# EAGLE design MG307_RFM69CW_V3 (EAGLE 8.6.1)
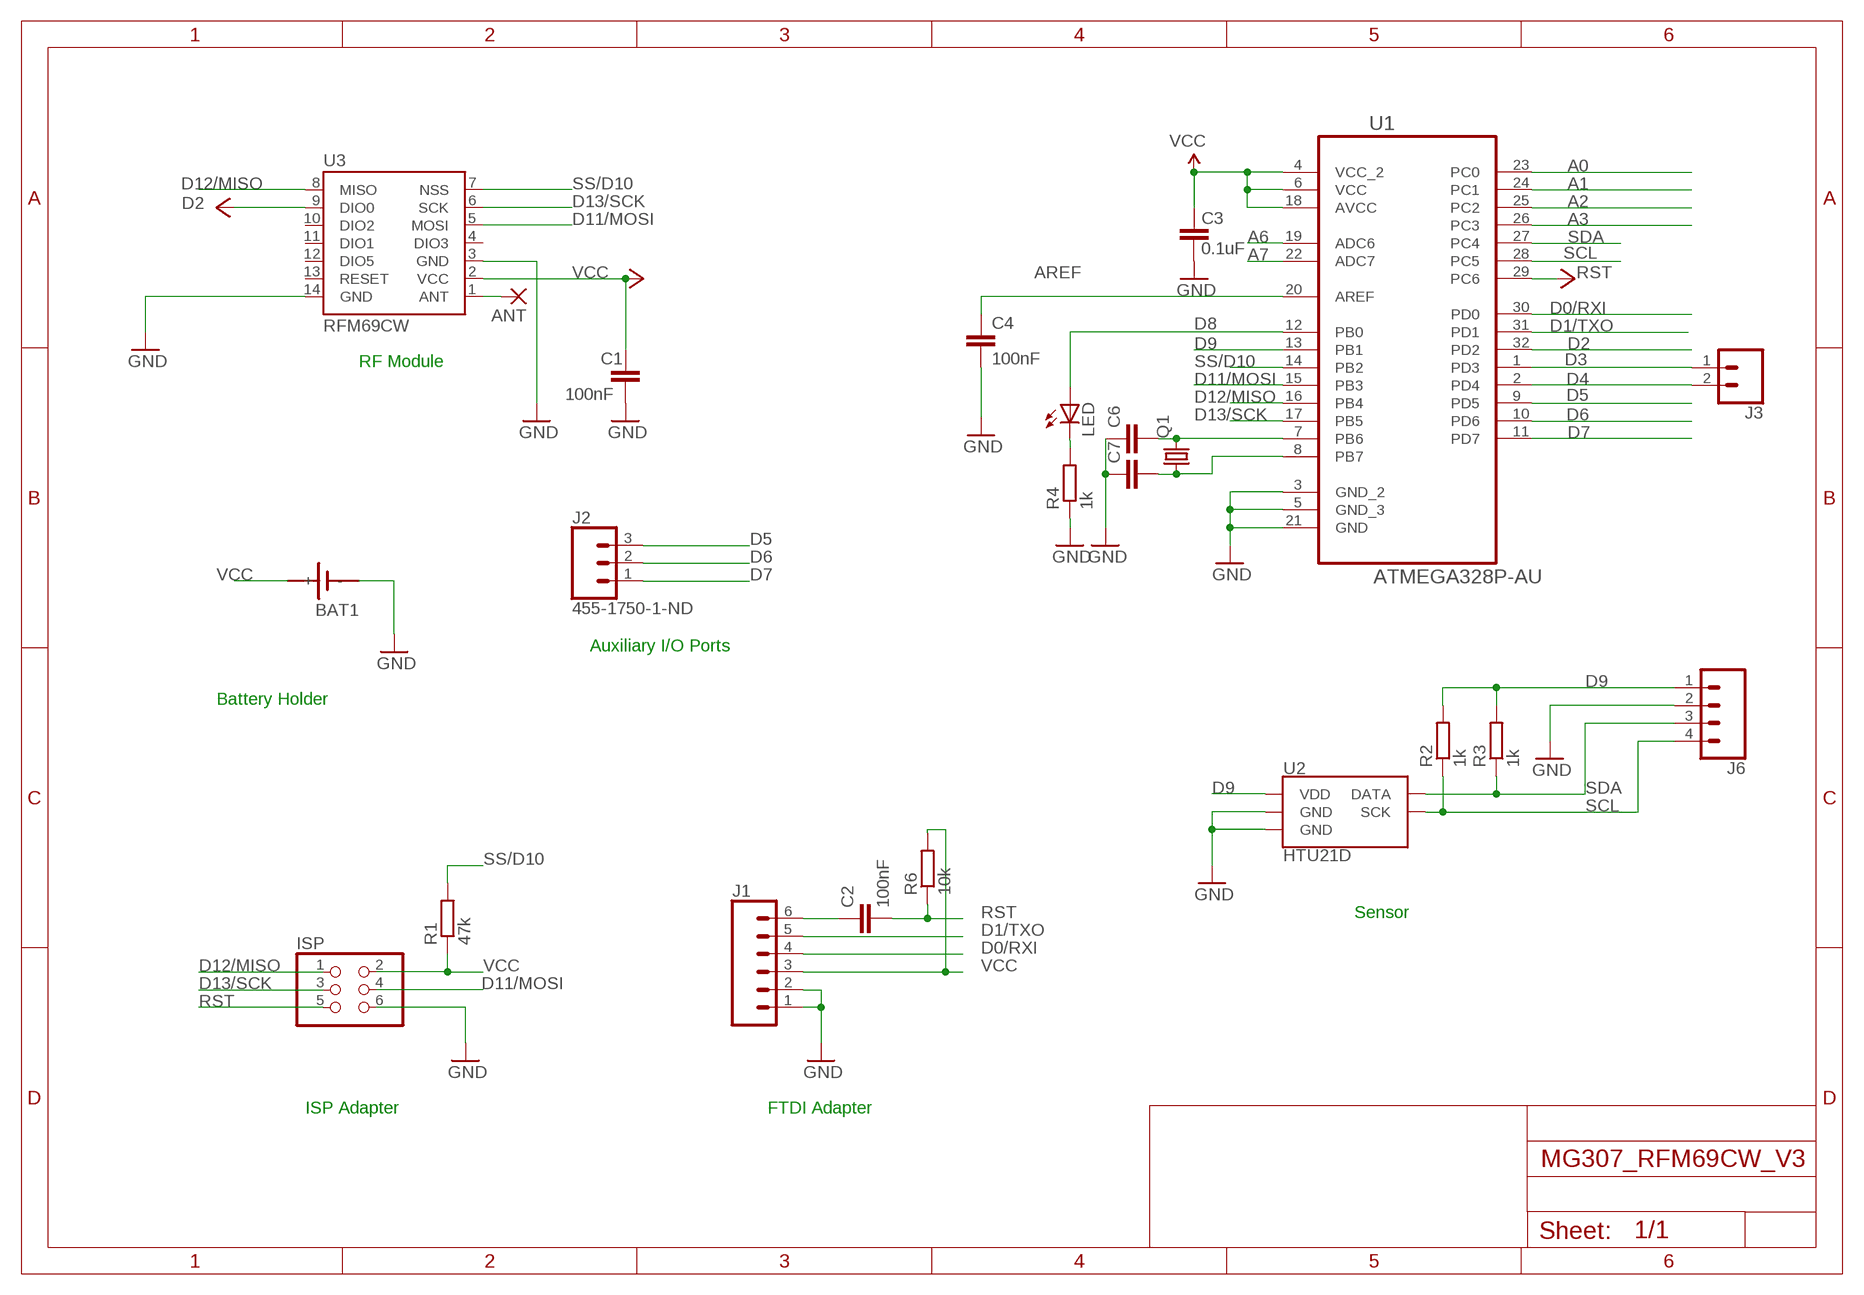
[diagram p0: schematic, sheet 1]

## Parts
ANT  WIREPAD1,6/0,9  [1,6/0,9]
BAT1  SN2032  [SN2032]
C1  100nF  C-EUC0603  [C0603]
C2  100nF  C-EUC0603  [C0603]
C3  0.1uF  CAP0603-CAP  [0603-CAP]
C4  100nF  C-EUC0603  [C0603]
C6  C-EUC0402  [C0402]
C7  C-EUC0402  [C0402]
ISP  PINHD-2X3  [2X03]
J1  CONN_06SILK_FEMALE_PTH  [1X06]
J2  455-1750-1-ND  CONN_03  [1X03]
J3  CONN_02  [1X02]
J6  CONN_04  [1X04]
LED  LEDCHIPLED_0603  [CHIPLED_0603]
Q1  CRYSTALTC26V  [TC26V]
R1  47k  R-EU_R0603  [R0603]
R2  1k  R-EU_R0603  [R0603]
R3  1k  R-EU_R0603  [R0603]
R4  1k  R-EU_R0603  [R0603]
R6  10k  R-EU_R0603  [R0603]
U1  ATMEGA328P-AU  [QFP80P900X900X120-32N]
U2  HTU21D  [DFN-6-3X3-HTU21D]
U3  RFM69CW  [RFM69CW]

## Nets
A0: U1.23(PC0)
A1: U1.24(PC1)
A2: U1.25(PC2)
A3: U1.26(PC3)
A6: U1.19(ADC6)
A7: U1.22(ADC7)
ANT: ANT.1(P) U3.1(ANT)
AREF: C4.1 U1.20(AREF)
D0/RXI: J1.4 U1.30(PD0)
D1/TXO: J1.5 U1.31(PD1)
D2: U1.32(PD2) U3.9(DIO0)
D3: J3.1 U1.1(PD3)
D4: J3.2 U1.2(PD4)
D5: J2.3 U1.9(PD5)
D6: J2.2 U1.10(PD6)
D7: J2.1 U1.11(PD7)
D8: LED.A U1.12(PB0)
D9: J6.1 R2.2 R3.2 U1.13(PB1) U2.VDD
D11/MOSI: ISP.4 U1.15(PB3) U3.5(MOSI)
D12/MISO: ISP.1 U1.16(PB4) U3.8(MISO)
D13/SCK: ISP.3 U1.17(PB5) U3.6(SCK)
DTR: C2.1 J1.6
GND: BAT1.- C1.2 C3.1 C4.2 C6.1 C7.1 ISP.6 J1.1 J1.2 J6.2 R4.1 U1.3(GND_2) U1.5(GND_3) U1.21(GND) U2.7(GND) U2.GND U3.14(GND)
GND1: LED.C R4.2
N$6: C6.2 Q1.2 U1.7(PB6)
N$7: C7.2 Q1.1 U1.8(PB7)
RST: C2.2 ISP.5 R6.1 U1.29(PC6)
SCL: J6.4 R2.1 U1.28(PC5) U2.SCK
SDA: J6.3 R3.1 U1.27(PC4) U2.DATA
SS/D10: R1.2 U1.14(PB2) U3.7(NSS)
VCC: BAT1.+ C1.1 C3.2 ISP.2 J1.3 R1.1 R6.2 U1.4(VCC_2) U1.6(VCC) U1.18(AVCC) U3.2(VCC)
Unconnected: U3.4(DIO3) U3.10(DIO2) U3.11(DIO1) U3.12(DIO5)

## Notes on the sheet
- RF Module
- Auxiliary I/O Ports
- Battery Holder
- Sensor
- ISP Adapter | FTDI Adapter

## Power pins joined to a net without a drawn wire
GND: U3.3(GND)
RESET: U3.13(RESET)

## Library data of the parts
ANT = wirepad:WIREPAD: Wire PAD connect wire on PCB
BAT1 = sn2032_AH:SN2032: LI BATTERY
C1 C2 C4 C6 C7 = rcl:C-EU: CAPACITOR, European symbol; SPICEPREFIX: C
C3 = SparkFun:CAP: Capacitor Standard 0603 ceramic capacitor, and 0.1" leaded capacitor.
ISP = pinhead:PINHD-2X3: PIN HEADER
J1 = SparkFun-Connectors:CONN_06: Multi connection point. Often used as Generic Header-pin footprint for 0.1 inch spaced/style header connections On any of the 0.1 inch spaced packages, you can populate with these: Break Away Headers - Straight <https://www.sparkfun.com/products/116> (PRT-00116) Break Away Male Headers - Right Angle <https://www.sparkfun.com/products/553> (PRT-00553) Female Headers <https://www.sparkfun.com/products/115> (PRT-00115) Break Away Headers - Machine Pin <https://www.sparkfun.com/products/117> (PRT-00117) Break Away Female Headers - Swiss Machine Pin <https://www.sparkfun.com/products/743> (PRT-00743) Arduino Stackable Header - 6 Pin <https://www.sparkfun.com/products/9280> (PRT-09280) For SCREWTERMINALS and SPRING TERMINALS visit here: Screw Terimnals on SparkFun.com <https://www.sparkfun.com/search/results?term=Screw+Terminals> (5mm/3.5mm/2.54mm spacing) This device is also useful as a general connection point to wire up your design to another part of your project. Our various solder wires solder well into these plated through hole pads. Hook-Up Wire - Assortment (Stranded, 22 AWG) <https://www.sparkfun.com/products/11375> (PRT-11375) Hook-Up Wire - Assortment (Solid Core, 22 AWG) <https://www.sparkfun.com/products/11367> (PRT-11367) View the entire wire category on our website here <https://www.sparkfun.com/categories/141>; PROD_ID: CONN-08437
J2 = SparkFun-Connectors:CONN_03: Multi connection point. Often used as Generic Header-pin footprint for 0.1 inch spaced/style header connections On any of the 0.1 inch spaced packages, you can populate with these: Break Away Headers - Straight <https://www.sparkfun.com/products/116> (PRT-00116) Break Away Male Headers - Right Angle <https://www.sparkfun.com/products/553> (PRT-00553) Female Headers <https://www.sparkfun.com/products/115> (PRT-00115) Break Away Headers - Machine Pin <https://www.sparkfun.com/products/117> (PRT-00117) Break Away Female Headers - Swiss Machine Pin <https://www.sparkfun.com/products/743> (PRT-00743) Stackable Header - 3 Pin (Female, 0.1") <https://www.sparkfun.com/products/13875> (PRT-13875) For SCREWTERMINALS and SPRING TERMINALS visit here: Screw Terimnals on SparkFun.com <https://www.sparkfun.com/search/results?term=Screw+Terminals> (5mm/3.5mm/2.54mm spacing) This device is also useful as a general connection point to wire up your design to another part of your project. Our various solder wires solder well into these plated through hole pads. Hook-Up Wire - Assortment (Stranded, 22 AWG) <https://www.sparkfun.com/products/11375> (PRT-11375) Hook-Up Wire - Assortment (Solid Core, 22 AWG) <https://www.sparkfun.com/products/11367> (PRT-11367) View the entire wire category on our website here <https://www.sparkfun.com/categories/141> Special notes: Molex polarized connector foot print use with SKU : PRT-08232 with associated crimp pins and housings.; PROD_ID: XXX-00000
J3 = SparkFun-Connectors:CONN_02: Multi connection point. Often used as Generic Header-pin footprint for 0.1 inch spaced/style header connections On any of the 0.1 inch spaced packages, you can populate with these: Break Away Headers - Straight <https://www.sparkfun.com/products/116> (PRT-00116) Break Away Male Headers - Right Angle <https://www.sparkfun.com/products/553> (PRT-00553) Female Headers <https://www.sparkfun.com/products/115> (PRT-00115) Break Away Headers - Machine Pin <https://www.sparkfun.com/products/117> (PRT-00117) Break Away Female Headers - Swiss Machine Pin <https://www.sparkfun.com/products/743> (PRT-00743) For SCREWTERMINALS and SPRING TERMINALS visit here: Screw Terimnals on SparkFun.com <https://www.sparkfun.com/search/results?term=Screw+Terminals> (5mm/3.5mm/2.54mm spacing) This device is also useful as a general connection point to wire up your design to another part of your project. Our various solder wires solder well into these plated through hole pads. Hook-Up Wire - Assortment (Stranded, 22 AWG) <https://www.sparkfun.com/products/11375> (PRT-11375) Hook-Up Wire - Assortment (Solid Core, 22 AWG) <https://www.sparkfun.com/products/11367> (PRT-11367) View the entire wire category on our website here <https://www.sparkfun.com/categories/141> Special notes: Molex polarized connector foot print use with: PRT-08233 with associated crimp pins and housings. 2.54_SCREWTERM for use with PRT-10571. 3.5mm Screw Terminal footprints for PRT-08084 5mm Screw Terminal footprints for use with PRT-08432
J6 = SparkFun-Connectors:CONN_04: Multi connection point. Often used as Generic Header-pin footprint for 0.1 inch spaced/style header connections On any of the 0.1 inch spaced packages, you can populate with these: Break Away Headers - Straight <https://www.sparkfun.com/products/116> (PRT-00116) Break Away Male Headers - Right Angle <https://www.sparkfun.com/products/553> (PRT-00553) Female Headers <https://www.sparkfun.com/products/115> (PRT-00115) Break Away Headers - Machine Pin <https://www.sparkfun.com/products/117> (PRT-00117) Break Away Female Headers - Swiss Machine Pin <https://www.sparkfun.com/products/743> (PRT-00743) For SCREWTERMINALS and SPRING TERMINALS visit here: Screw Terimnals on SparkFun.com <https://www.sparkfun.com/search/results?term=Screw+Terminals> (5mm/3.5mm/2.54mm spacing) This device is also useful as a general connection point to wire up your design to another part of your project. Our various solder wires solder well into these plated through hole pads. Hook-Up Wire - Assortment (Stranded, 22 AWG) <https://www.sparkfun.com/products/11375> (PRT-11375) Hook-Up Wire - Assortment (Solid Core, 22 AWG) <https://www.sparkfun.com/products/11367> (PRT-11367) View the entire wire category on our website here <https://www.sparkfun.com/categories/141> Special notes: Molex polarized connector foot print use with SKU : PRT-08231 with associated crimp pins and housings. 1MM SMD Version SKU: PRT-10208; PROD_ID: CONN-09696
LED = led:LED: LED OSRAM: - CHIPLED LG R971, LG N971, LY N971, LG Q971, LY Q971, LO R971, LY R971 LH N974, LH R974 LS Q976, LO Q976, LY Q976 LO Q996 - Hyper CHIPLED LW Q18S LB Q993, LB Q99A, LB R99A - SideLED LS A670, LO A670, LY A670, LG A670, LP A670 LB A673, LV A673, LT A673, LW A673 LH A674 LY A675 LS A676, LA A676, LO A676, LY A676, LW A676 LS A679, LY A679, LG A679 - Hyper Micro SIDELED® LS Y876, LA Y876, LO Y876, LY Y876 LT Y87S - SmartLED LW L88C, LW L88S LB L89C, LB L89S, LG L890 LS L89K, LO L89K, LY L89K LS L896, LA L896, LO L896, LY L896 - TOPLED LS T670, LO T670, LY T670, LG T670, LP T670 LSG T670, LSP T670, LSY T670, LOP T670, LYG T670 LG T671, LOG T671, LSG T671 LB T673, LV T673, LT T673, LW T673 LH T674 LS T676, LA T676, LO T676, LY T676, LB T676, LH T676, LSB T676, LW T676 LB T67C, LV T67C, LT T67C, LS T67K, LO T67K, LY T67K, LW E67C LS E67B, LA E67B, LO E67B, LY E67B, LB E67C, LV E67C, LT E67C LW T67C LS T679, LY T679, LG T679 LS T770, LO T770, LY T770, LG T770, LP T770 LB T773, LV T773, LT T773, LW T773 LH T774 LS E675, LA E675, LY E675, LS T675 LS T776, LA T776, LO T776, LY T776, LB T776 LHGB T686 LT T68C, LB T68C - Hyper Mini TOPLED® LB M676 - Mini TOPLED Santana® LG M470 LS M47K, LO M47K, LY M47K Source: http://www.osram.convergy.de LUXEON: - LUMILED® LXK2-PW12-R00, LXK2-PW12-S00, LXK2-PW14-U00, LXK2-PW14-V00 LXK2-PM12-R00, LXK2-PM12-S00, LXK2-PM14-U00 LXK2-PE12-Q00, LXK2-PE12-R00, LXK2-PE12-S00, LXK2-PE14-T00, LXK2-PE14-U00 LXK2-PB12-K00, LXK2-PB12-L00, LXK2-PB12-M00, LXK2-PB14-N00, LXK2-PB14-P00, LXK2-PB14-Q00 LXK2-PR12-L00, LXK2-PR12-M00, LXK2-PR14-Q00, LXK2-PR14-R00 LXK2-PD12-Q00, LXK2-PD12-R00, LXK2-PD12-S00 LXK2-PH12-R00, LXK2-PH12-S00 LXK2-PL12-P00, LXK2-PL12-Q00, LXK2-PL12-R00 Source: www.luxeon.com KINGBRIGHT: KA-3528ASYC Source: www.kingbright.com
Q1 = crystal:CRYSTAL: CRYSTAL; OC_FARNELL: unknown; OC_NEWARK: unknown
R1-R4 R6 = rcl:R-EU_: RESISTOR, European symbol
U1 = Atmel_By_element14_Batch_1-00:ATMEGA328P-AU: 8-bit Microcontroller with In-System Programmable Flash; MPN: ATMEGA328P-AU; OC_FARNELL: 1715486; OC_NEWARK: 14R4631; PACKAGE: TQFP-32; SUPPLIER: Atmel
U2 = SparkFun-Sensors:HTU21D: Measurement Specialties HTU21D Relative Humidity Sensor w/ Temperature HTU21D(F) digital humidity sensors are dedicated humidity and temperature plug and play transducers for OEM applications where reliable and accurate measurements are needed. Direct interface with a micro-controller is made possible with the module for humidity and temperature digital outputs. These low power sensors are designed for high volume and cost sensitive applications with tight space constraints. Datasheet <http://cdn.sparkfun.com/datasheets/BreakoutBoards/HTU21D.pdf> SparkFun Products SparkFun Humidity and Temperature Sensor Breakout - HTU21D <https://www.sparkfun.com/products/12064> (SEN-12064) SparkFun Weather Shield <https://www.sparkfun.com/products/12081> (SEN-12081) SparkFun Photon Weather Shield <https://www.sparkfun.com/products/13630> (SEN-13630); PROD_ID: IC-11793
U3 = RFM69xx:RFM69: The RFM69CW is a low-power, low cost radiotransceiver that is capable of operating in the 434MHz and 900MHz open bands. It supports OOK, FSK and GFSK Modulation. It is pin compatible to the RFM12B

## Net classes
1 vcc: width 0.254 mm

## Board
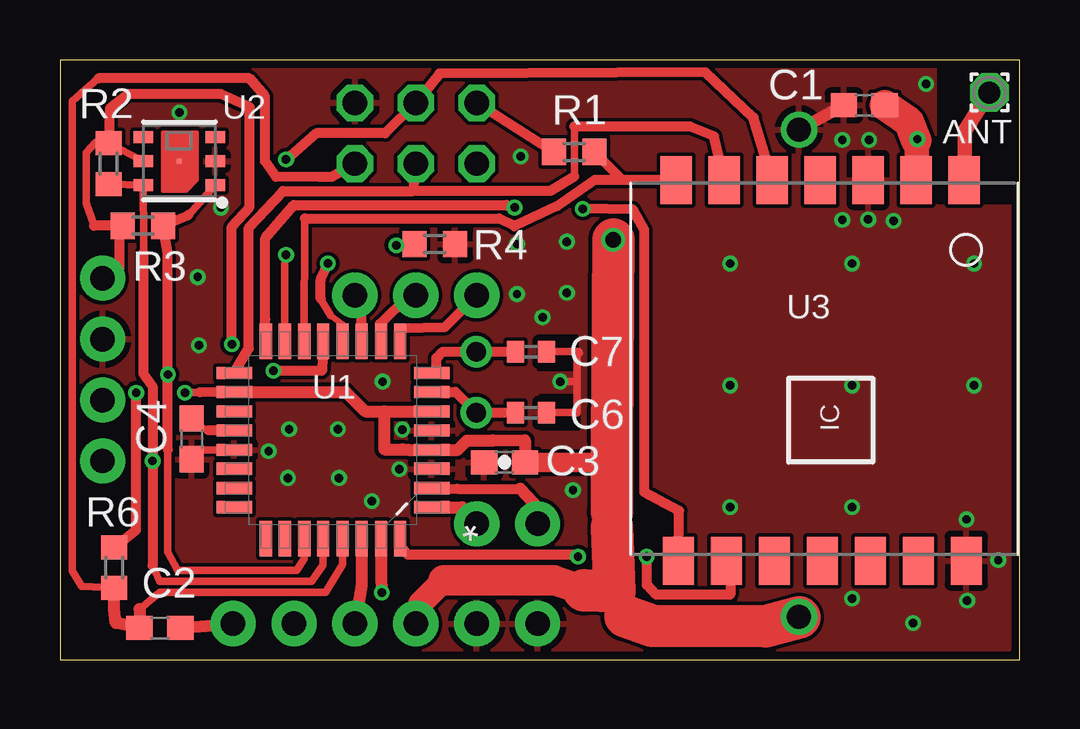
[diagram p1: board, top side]
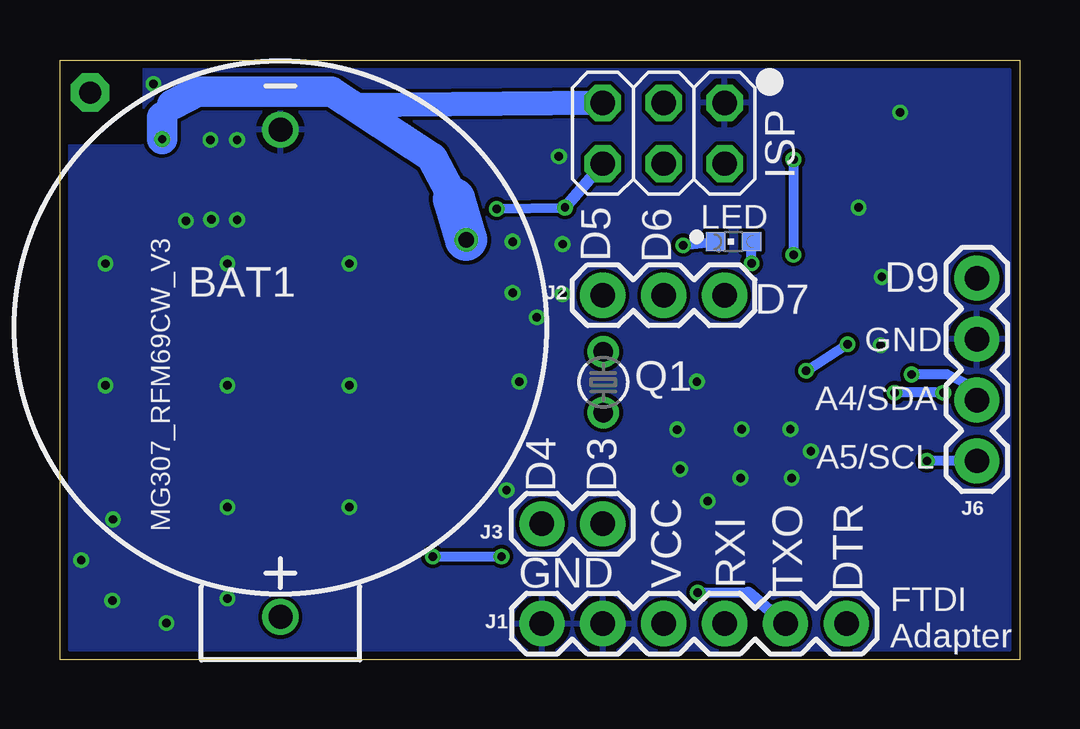
[diagram p2: board, bottom side, seen from below]

Size 40 x 25 mm. Coordinates in mm from the lower left corner, seen from the top.
Outline: 0,0 40,0 40,25 0,25 0,0
Copper layers (1*16): Top 0.035mm / dielectric 1.5mm / Bottom 0.035mm
Design rules "SeeedStudio_2layer_DRU_no_angle_20140221": minimum track width 6mil, minimum drill 12mil, track to track 6mil, track to pad 6mil, pad to pad 6mil, via to via 6mil, smd to smd 0mil, copper to edge 10mil, drill to drill 10mil, minimum pad ring 10mil, minimum via ring 6mil, stop-mask expansion 2mil, vias tented up to drill 100mil, thermal gap 10mil

### Footprints (pad centres in the part's own frame; a part is rotated, then mirrored left to right if it is on the bottom)
1,6/0,9 = drill 0.914 pad 1.6 octagon: 1 0,0
SN2032 = drill 1: + 0,12.065; - 0,-8.255
C0603 = smd 1.1 x 1: 1 -0.85,0; 2 0.85,0
0603-CAP = smd 1.1 x 1: 1 -0.85,0; 2 0.85,0
C0402 = smd 0.7 x 0.9: 1 -0.65,0; 2 0.65,0
2X03 = drill 1.016 octagon: 1 -2.54,-1.27; 2 -2.54,1.27; 3 0,-1.27; 4 0,1.27; 5 2.54,-1.27; 6 2.54,1.27
1X06 = drill 1.016 pad 1.88: 1 0,0; 2 2.54,0; 3 5.08,0; 4 7.62,0; 5 10.16,0; 6 12.7,0
1X03 = drill 1.016 pad 1.88: 1 0,0; 2 2.54,0; 3 5.08,0
1X02 = drill 1.016 pad 1.88: 1 0,0; 2 2.54,0
1X04 = drill 1.016 pad 1.88: 1 0,0; 2 2.54,0; 3 5.08,0; 4 7.62,0
CHIPLED_0603 = smd 0.8 x 0.8: A 0,-0.75; C 0,0.75
TC26V = drill 0.813: 1 -1.27,0; 2 1.27,0
R0603 = smd 1 x 1.1: 1 -0.85,0; 2 0.85,0
QFP80P900X900X120-32N = smd 1.473 x 0.508: 1 -4.115,2.794; 2 -4.115,2.007; 3 -4.115,1.194; 4 -4.115,0.406; 5 -4.115,-0.406; 6 -4.115,-1.194; 7 -4.115,-2.007; 8 -4.115,-2.794; 17 4.115,-2.794; 18 4.115,-2.007; 19 4.115,-1.194; 20 4.115,-0.406; 21 4.115,0.406; 22 4.115,1.194; 23 4.115,2.007; 24 4.115,2.794 | smd 0.508 x 1.473: 9 -2.794,-4.115; 10 -2.007,-4.115; 11 -1.194,-4.115; 12 -0.406,-4.115; 13 0.406,-4.115; 14 1.194,-4.115; 15 2.007,-4.115; 16 2.794,-4.115; 25 2.794,4.115; 26 2.007,4.115; 27 1.194,4.115; 28 0.406,4.115; 29 -0.406,4.115; 30 -1.194,4.115; 31 -2.007,4.115; 32 -2.794,4.115
DFN-6-3X3-HTU21D = smd 0.2 x 0.2: 7 0,0 | smd 0.8 x 0.5: DATA 1.5,-1; GND 1.5,0; NC@1 -1.5,1; NC@6 1.5,1; SCK -1.5,-1; VDD -1.5,0
RFM69CW = smd 2 x 1.3: 1 8,-6.27; 2 8,-4.27; 3 8,-2.27; 4 8,-0.27; 5 8,1.73; 6 8,3.73; 7 8,5.73; 8 -7.875,5.635; 9 -7.875,3.635; 10 -7.875,1.635; 11 -7.875,-0.365; 12 -7.875,-2.365; 13 -7.875,-4.365; 14 -7.875,-6.365

### Placement (x,y rotation side)
ANT  38.75,23.64 0 top
BAT1  30.81,13.84 180 bottom
C1  33.53,23.11 180 top
C2  4.17,1.32 180 top
C3  18.54,8.22 0 top
C4  5.49,9.2 270 top
C6  19.63,10.29 180 top
C7  19.63,12.83 180 top
ISP  14.83,21.95 0 bottom
J1  19.91,1.5 0 bottom
J2  12.29,15.19 180 bottom
J3  17.37,5.66 180 bottom
J6  1.78,15.9 270 bottom
LED  11.91,17.42 90 bottom
Q1  17.35,11.56 270 bottom
R1  21.44,21.16 0 top
R2  2.03,20.68 90 top
R3  3.45,18.09 180 top
R4  15.62,17.32 180 top
R6  2.26,3.84 90 top
U1  11.38,9.15 180 top
U2  4.98,20.78 0 top
U3  31.42,12 90 top

### Tracks (layer width: path | path; a pad name or v marks a point on that pad's centre or on a via)
ANT
  Top 0.2: 38.1,20.38 U3.1
  Top 0.61: U3.1 37.72,22.05 ANT.1
AREF
  Top 0.2: 6.19,9.56 C4.1
  Top 0.406: U1.20 6.19,9.56
D0/RXI
  Top 0.508: U1.30 12.57,3.12 J1.4
D1/TXO  (via drill 0.35)
  Top 0.508: U1.31 13.39,3.53 v13.41,2.79
  Bottom 0.406: v13.41,2.79 11.3,2.79
  Bottom 0.508: 11.3,2.79 J1.5
D2  (via drill 0.35)
  Top 0.305: v21.59,4.29 21.64,4.37
  Top 0.406: v24.46,4.29 24.46,3.11 24.84,2.7 27.94,2.7 27.94,4.25 U3.9 | 21.64,4.37 14.5,4.37 14.22,4.68 U1.32
  Bottom 0.406: v24.46,4.29 v21.59,4.29
D3
  Top 0.406: U1.1
  Top 0.508: U1.1 16.76,6.35 17.27,5.84 J3.1
D4
  Top 0.406: U1.2 16.57,7.12 | 16.57,7.12 16.76,7.11 | 16.57,7.12 19.2,7.12
  Top 0.508: J3.2 19.91,6.35 19.2,7.12
D5
  Top 0.406: U1.9 14.22,13.82 16.05,13.87 J2.3
D6
  Top 0.2: U1.10 13.39,13.32
  Top 0.406: U1.10 13.34,13.99 14.58,15.19 J2.2
D7
  Top 0.406: U1.11 12.57,14.61 J2.1
D8  (via drill 0.35)
  Top 0.254: U1.12 11.79,13.98 11.28,14.35
  Top 0.305: 11.28,14.35 10.87,15.04
  Top 0.406: 10.87,15.04 10.87,15.84 v11.17,16.52
  Bottom 0.152: LED.A
  Bottom 0.406: v11.17,16.52 LED.A
D9  (via drill 0.35)
  Top 0.305: U2.VDD R2.2 1.47,21.55 1.1,21.14 1.1,19.02 1.42,18.09
  Top 0.406: R3.2 2.49,18.09 | 2.49,18.09 1.42,18.09 | U1.13 10.92,12.04 v8.89,12.04 | v7.16,13.15 7.16,18.05 7.9,18.87 7.9,19.17 7.92,23.02 6.7,23.58 2.84,23.58 2.08,22.97 R2.2 | J6.1 2.49,16.31 2.49,18.09
  Bottom 0.406: v8.89,12.04 v7.16,13.15
D11/MOSI  (via drill 0.35)
  Top 0.305: 9.4,17 9.37,16.4 U1.15
  Top 0.406: U3.5 28.91,22.59 26.91,24.49 15.81,24.43 ISP.4 13.56,21.95 10.69,21.95 v9.42,20.85 | v9.42,16.88 9.4,17
  Bottom 0.406: v9.42,20.85 v9.42,16.88
D12/MISO  (via drill 0.35)
  Top 0.406: U3.8 25.81,6.21 24.36,6.97 24.36,17.91 23.88,18.77 v21.79,18.8 | v18.95,18.85 18.6,18.95 9.75,18.95 8.56,17.57 8.56,14.19 U1.16
  Bottom 0.406: v21.79,18.8 v18.95,18.85
  Bottom 0.508: v18.95,18.85 ISP.1
D13/SCK
  Top 0.305: 21.44,22.23 21.44,20.14
  Top 0.406: U3.6 27.26,21.82 26.27,22.23 21.44,22.23 | 21.44,20.14 20.44,19.53 14.73,19.53 | 14.73,19.53 ISP.3 | U1.17 7.87,12.96 7.87,18.01 9.3,19.53 14.73,19.53
DTR
  Top 0.508: C2.1 J1.6
GND  (via drill 0.35)
  Top 0.305: 15.49,7.88 U1.3 | C7.1 21.61,12.83 21.65,12.79 21.55,12.69 21.55,11.59 | 21.55,11.59 21.55,10.29 C6.1 | v20.85,11.59 21.55,11.59 | C4.2 5.88,8.74 U1.21
  Top 0.508: BAT1.- C1.2
  other vias: 4.98,22.82 13.45,11.59 8.7,8.69 14.15,7.94 33.7,18.35 38.1,16.51 33.02,16.51 27.94,16.51 38.1,11.43 33.02,11.43 27.94,11.43 27.94,6.35 33.02,6.35 37.8,5.84 33.02,2.54 37.82,2.46 35.56,1.52 33.73,21.67 36.1,24 14.27,9.59 32.61,21.67 32.61,18.34 34.75,18.29 39.12,4.14 21.39,7.06 19.2,20.98 6.71,18.85 5.74,15.95 5.79,13.11 19.05,17.32 21.13,17.42 19.05,15.24 21.13,15.29 20.12,14.27 13,6.6 9.55,9.6 11.58,9.6 9.5,7.57 11.63,7.57
  pour Bottom: 0.4,24.6 39.6,24.6 39.6,0.4 0.4,0.4
  pour Top: 0.4,24.6 39.6,24.6 39.6,0.4 0.4,0.4
  cutout Top: 19.95,13.49 21.55,13.49 21.55,12.09 19.95,12.09
  cutout Top: 36.63,24.6 39.67,24.6 39.67,19.05 36.63,19.05
GND1  (via drill 0.35)
  Top 0.406: R4.2 14.06,17.23 v14.02,17.27
  Bottom 0.406: v14.02,17.27 LED.C
GND2
  cutout Top: 20.03,11.02 21.63,11.02 21.63,9.62 20.03,9.62
GND3
  cutout Bottom: 36.63,24.6 39.67,24.6 39.67,21.55 36.63,21.55
N$6
  Top 0.2: 19.11,10.29 C6.2
  Top 0.406: U1.7 16.48,11.16 Q1.2 C6.2
N$7
  Top 0.2: U1.8 15.7,12.15
  Top 0.406: 15.7,12.15 15.7,12.58 15.95,12.83 Q1.1 C7.2
RST
  Top 0.305: R6.1 0.9,3.06 0.51,3.71 0.51,23.29 1.6,24.23 | U1.29 11.79,3.96 11.07,2.79 4.17,2.79 3.32,2.1
  Top 0.406: ISP.5 11.33,20.12 10.82,20.12 9,20.13 8.55,20.78 8.55,23.48 7.9,24.23 1.6,24.23
  Top 0.508: 3.32,2.1 C2.2 2.33,1.52 2.25,2.1 R6.1
SCL  (via drill 0.35)
  Top 0.305: 3.86,3.91 4.17,3.25 10.5,3.25 10.97,3.95 U1.28 | 3.48,16.97 3.48,17.6 U2.SCK R2.1
  Top 0.406: 3.86,3.91 v3.86,8.28 3.86,11.39 3.48,11.91 3.48,16.97
  Bottom 0.406: J6.4 v3.86,8.28
SDA  (via drill 0.35)
  Top 0.305: U1.27 10.19,4.2 9.86,3.71 4.9,3.71 4.5,4.49 4.5,7.57 4.5,8.76 | 5.36,18.53 U2.DATA | 4.3,18 R3.1
  Top 0.406: 4.5,8.76 v4.5,11.89 4.5,16.99 4.3,18 | R3.1 5.36,18.53
  Bottom 0.406: J6.3 1.83,11.3 3.02,11.89 v4.5,11.89
SS/D10
  Top 0.305: U1.14 10.2,18.39 | 24.22,20 23.45,20
  Top 0.406: 10.2,18.39 18.31,18.39 18.94,18.07 20.75,18.92 22.29,19.99 24.22,20 U3.7 | 23.45,20 R1.2
VCC  (via drill 0.35, 0.65)
  Top 0.2: 35.72,21.62 35.7,21.63 v35.74,21.7 | 15.19,8.77 15.52,8.77 U1.4
  Top 0.305: 5.82,11.14 5.81,11.12 v5.21,11.12
  Top 0.406: v3.17,11.12 3.17,5.4 R6.2 | U1.18 5.82,11.14 | ISP.2 R1.1
  Top 0.508: U1.18 11.91,11.16 12.72,10.34 13.52,10.34 | 13.52,10.34 U1.6 | 13.52,10.34 13.52,8.77 14.3,8.77 14.53,8.74 U1.4 16.58,8.74 16.97,9.13 18.03,9.13 18.05,9.15 19.38,9.14 C3.2 | 23.07,8.22 23,9.22
  Top 0.813: C3.2 23.07,8.22
  Top 1.016: U3.2 35.72,21.62 | 23.19,8.81 23,9.22 23.01,9.14 | J1.3 15.03,2.34 16,3.3 | 23,6.16 23.25,5.8 23.25,5.38 23.02,5.51 | 23.57,1.8 23.12,2.85 | 30.82,1.76 BAT1.+
  Top 1.27: C1.1 35.38,22.42 35.7,21.63 | 16,3.3 20.6,3.3 21.84,2.88
  Top 1.778: 23.01,9.14 v23.06,17.5 | 21.84,2.88 23.12,2.85 23.02,5.51 | 23,9.22 23,6.16 | 23.57,1.8 24.7,1.4 29.41,1.39 30.82,1.76
  Bottom 0.254: 27.89,23.11 28.68,23.67
  Bottom 0.406: v3.17,11.12 v5.21,11.12
  Bottom 1.016: 35.74,22.62 35.33,23.14 | ISP.2 27.89,23.11
  Bottom 1.27: v35.74,21.7 35.74,22.62 | 23.58,19.21 24.48,20.93 28.68,23.67 34.27,23.67 35.33,23.14
  Bottom 1.778: v23.06,17.5 23.58,19.21

### Text on the board
bPlace: D6 | D5 | MG307_RFM69CW_V3 | D7 | D9 | GND | A4/SDA | D3 | D4 | A5/SCL | DTR | VCC | TXO | RXI | GND | FTDI / Adapter